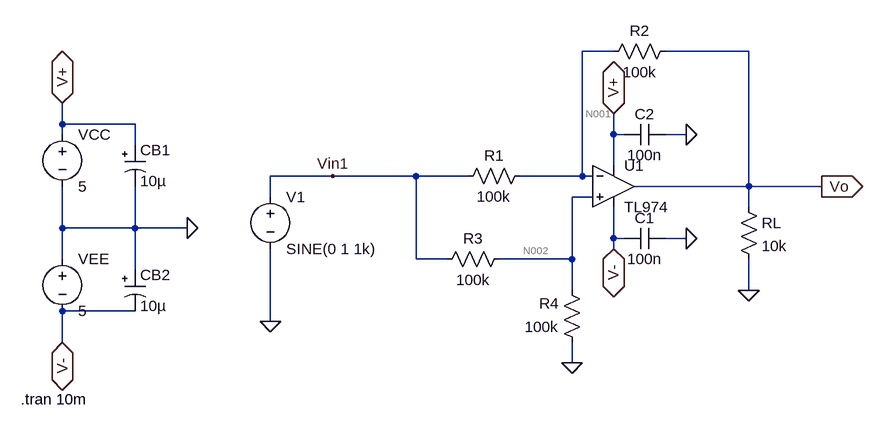
[diagram p0: schematic q6_1.asc]
* q6_1.asc
VCC V+ 0 5
VEE 0 V- 5
* U1: TL974 (symbol TL974 not available, pins judged from their places): In+=N002 In-=N001 V+=V+ V-=V- OUT=Vo
R2 Vo N001 100k
C1 0 V- 100n
C2 0 V+ 100n
RL Vo 0 10k
CB1 V+ 0 10µ
CB2 0 V- 10µ
R3 N002 Vin1 100k
R4 0 N002 100k
R1 N001 Vin1 100k
V1 Vin1 0 SINE(0 1 1k)
.tran 10m
.backanno
.end

* Results of the author's LTspice run, read from the files saved beside the schematic
* Operating Point, zero values left out:
*   V(v+) = 5 V
*   V(v-) = -5 V
*   V(n002) = 10.5 mV
*   V(n001) = 8.69 mV
*   V(vo) = -2.621 mV
*   I(R2) = -113.1 nA
*   I(Rl) = -262.1 nA
*   I(R3) = 105 nA
*   I(R4) = -105 nA
*   I(R1) = 86.9 nA
*   I(Vcc) = -2 mA
*   I(Vee) = -2 mA
*   I(V1) = 191.9 nA
*   Ix(u1:INP) = -210 nA
*   Ix(u1:INN) = -200 nA
*   Ix(u1:VCC) = 2 mA
*   Ix(u1:VEE) = -2 mA
*   Ix(u1:OUT) = 375.2 nA
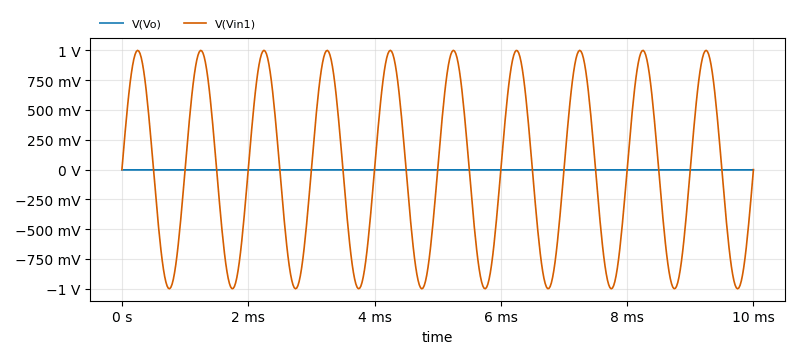
[diagram p1: Transient Analysis of q6_1.asc, plotted from the saved traces]
* Transient Analysis, 1 run:
*   V(Vo): min -2.677 mV, max -2.565 mV, average -2.621 mV, rms 2.621 mV, last -2.621 mV
*   V(Vin1): min -1 V, max 1 V, average -183.1 nV, rms 707.1 mV, last 0 V